# Altium schematic sheet d202.SchDoc
size C; SheetNumber: 1; SheetTotal: 5
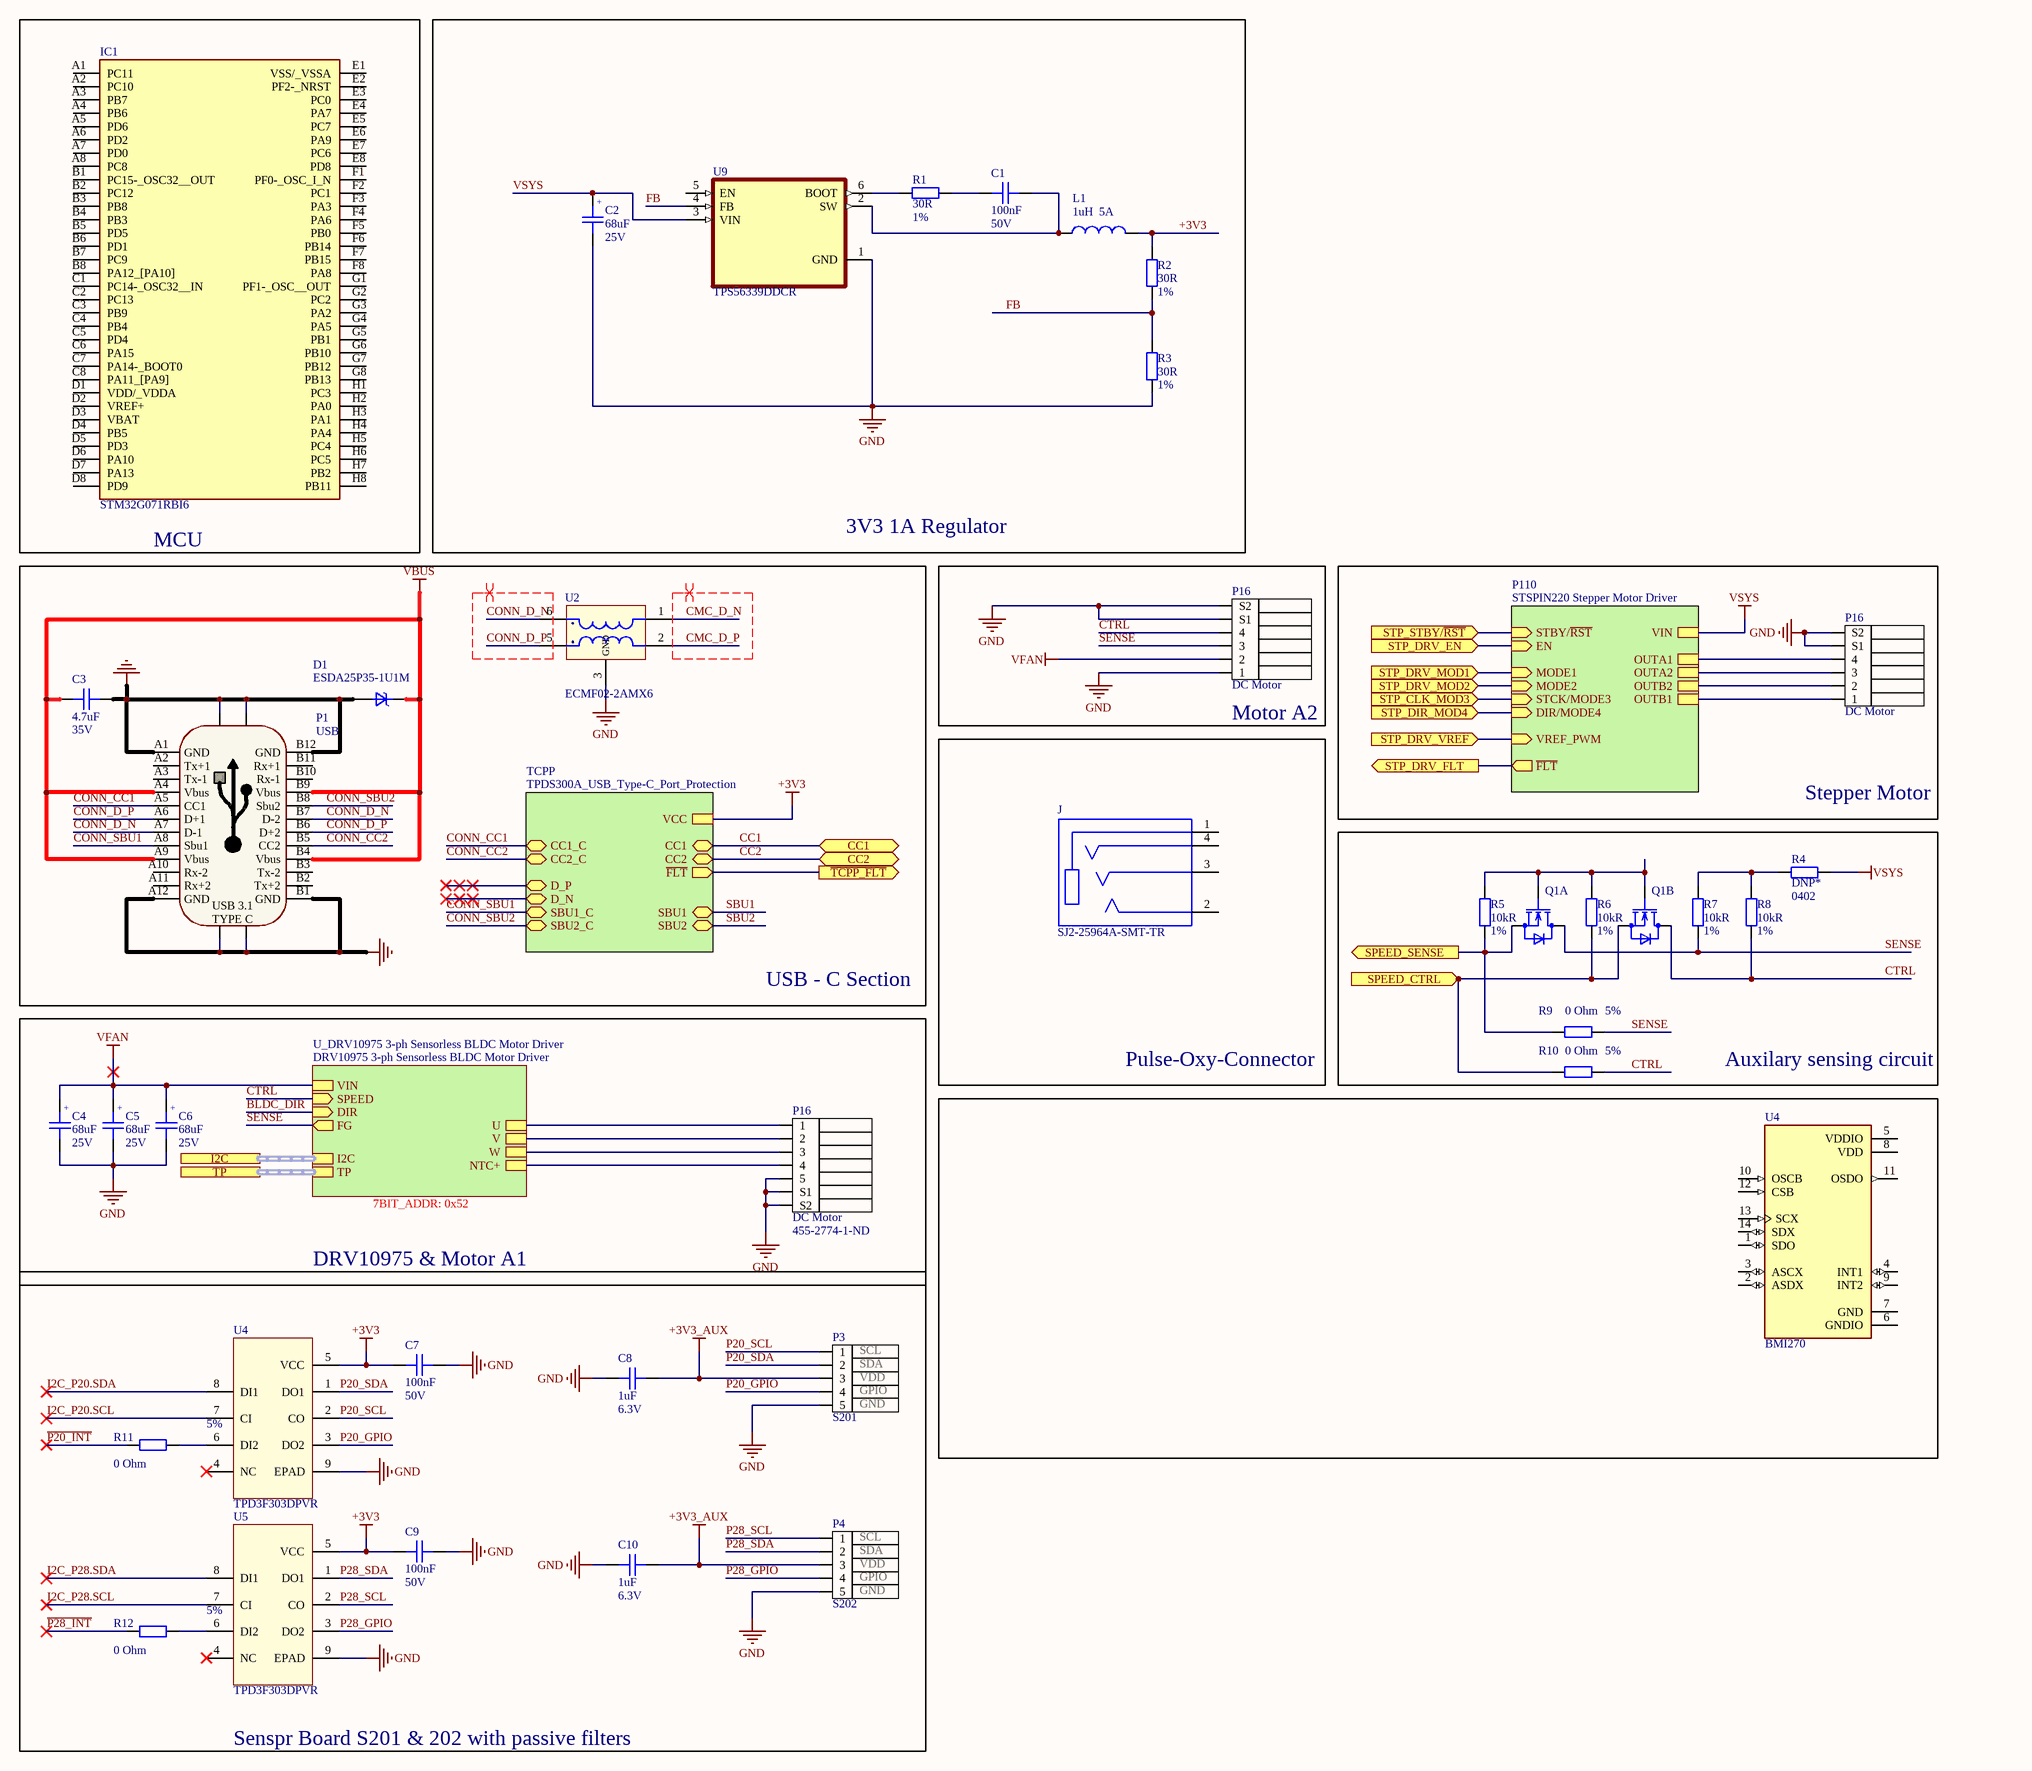
[diagram p0: d202.SchDoc]

## Parts
(Parts that share a designator on the sheet are numbered #1, #2 ... from top to bottom, then left to right.)
C1  Capacitance: 100nF  Voltage Rating: 50V  [C0402]  (hidden comment: CAP CER 1UF 6.3V X5R 0402)
C2  Capacitance: 68uF  Rated Voltage: 25V  [WCAP-ASLI_6.3x5.5]  (hidden comment: CAP ALUM 68 UF 20% 25 V SMD)
C3  Capacitance: 4.7uF  Voltage Rating: 35V  [C0805]  (hidden comment: CAP CER 4.7UF 35V X7R 0805)
C4  Capacitance: 68uF  Rated Voltage: 25V  [WCAP-ASLI_6.3x5.5]  (hidden comment: CAP ALUM 68 UF 20% 25 V SMD)
C5  Capacitance: 68uF  Rated Voltage: 25V  [WCAP-ASLI_6.3x5.5]  (hidden comment: CAP ALUM 68 UF 20% 25 V SMD)
C6  Capacitance: 68uF  Rated Voltage: 25V  [WCAP-ASLI_6.3x5.5]  (hidden comment: CAP ALUM 68 UF 20% 25 V SMD)
C7  Capacitance: 100nF  Voltage: 50V  [C0402]  (hidden comment: CAP CER 0.1UF 50V X7R 0402)
C8  Capacitance: 1uF  Voltage Rating: 6.3V  [C0402]  (hidden comment: CAP CER 1UF 6.3V X5R 0402)
C9  Capacitance: 100nF  Voltage: 50V  [C0402]  (hidden comment: CAP CER 0.1UF 50V X7R 0402)
C10  Capacitance: 1uF  Voltage Rating: 6.3V  [C0402]  (hidden comment: CAP CER 1UF 6.3V X5R 0402)
D1  ESDA25P35-1U1M  [ST_QFN_1610]
IC1  STM32G071RBI6  [BGA64C50P8X8_500X500X60]
J  SJ2-25964A-SMT-TR  [CUI_SJ2-25964A-SMT-TR]
L1  Inductance: 1uH  Current Rating: 5A  [IND_IHLP-1212B00]  (hidden comment: FIXED IND 1UH 5A 24 MOHM SMD)
P1  USB  [MOLEX_2012670005]
P3  S201  pin_1: SCL  pin_2: SDA  pin_3: VDD  pin_4: GPIO  pin_5: GND  [CONN_0545500571]
P4  S202  pin_1: SCL  pin_2: SDA  pin_3: VDD  pin_4: GPIO  pin_5: GND  [CONN_0545500571]
P16#1  DC Motor  [JST_S4B-ZR-SM4A-TF(LF)(SN)]
P16#2  DC Motor  [SM04B-NSHSS-TB (LF)(SN)]
P16#3  DC Motor  Supplier Part Number 1: 455-2774-1-ND  [JST_S5B-ZR-SM4A-TF(LF)(SN)]
Q1  DMN32D2LV-7  [SON_400UV-7_DIO]  (value not drawn)  (parts A,B of 2)
R1  Resistance: 30R  Tolerance: 1%  [R0402]  (hidden comment: RES SMD 10K OHM 1% 1/16W 0402)
R2  Resistance: 30R  Tolerance: 1%  [R0402]  (hidden comment: RES SMD 10K OHM 1% 1/16W 0402)
R3  Resistance: 30R  Tolerance: 1%  [R0402]  (hidden comment: RES SMD 10K OHM 1% 1/16W 0402)
R4  DNP*  Case/Package: 0402  [R0402]  (no BOM)
R5  Resistance: 10kR  Tolerance: 1%  [R0402]  (hidden comment: RES SMD 10K OHM 1% 1/16W 0402)
R6  Resistance: 10kR  Tolerance: 1%  [R0402]  (hidden comment: RES SMD 10K OHM 1% 1/16W 0402)
R7  Resistance: 10kR  Tolerance: 1%  [R0402]  (hidden comment: RES SMD 10K OHM 1% 1/16W 0402)
R8  Resistance: 10kR  Tolerance: 1%  [R0402]  (hidden comment: RES SMD 10K OHM 1% 1/16W 0402)
R9  Tolerance: 5%  Resistance: 0 Ohm  [R0402]  (hidden comment: RES SMD 0 OHM JUMPER 1/16W 0402)
R10  Tolerance: 5%  Resistance: 0 Ohm  [R0402]  (hidden comment: RES SMD 0 OHM JUMPER 1/16W 0402)
R11  Tolerance: 5%  Resistance: 0 Ohm  [R0402]  (hidden comment: RES SMD 0 OHM JUMPER 1/16W 0402)
R12  Tolerance: 5%  Resistance: 0 Ohm  [R0402]  (hidden comment: RES SMD 0 OHM JUMPER 1/16W 0402)
U2  ECMF02-2AMX6  [QFN-6L]
U4#1  BMI270  [XDCR_BMI270]
U4#2  TPD3F303DPVR  [DPV8_1P7X0P4]
U5  TPD3F303DPVR  [DPV8_1P7X0P4]
U9  TPS56339DDCR  [SOT95P280X110-6N]

## Blocks framed on the sheet
MCU: IC1
3V3 1A Regulator: C1 C2 L1 R1-R3 U9
USB - C Section: C3 D1 P1 U2
Motor A2: P16#1
Stepper Motor: P16#2
Pulse-Oxy-Connector: J
Auxilary sensing circuit: Q1 R4-R10
DRV10975 & Motor A1: C4-C6 P16#3
Senspr Board S201 & 202 with passive filters: C7-C10 P3 P4 R11 R12 U4#2 U5

## Sub-sheets
P110 = STSPIN220 Stepper Motor Driver: MODE1 (in), OUTB1, VREF_PWM (in), EN (in), MODE2 (in), OUTB2, OUTA2, DIR/MODE4 (in), STCK/MODE3 (in), ~{FLT} (out), STBY/~{RST} (in), OUTA1, VIN
TCPP = TPDS300A_USB_Type-C_Port_Protection: ~{FLT} (out), VCC, CC1 (bidir), CC2 (bidir), CC1_C (bidir), CC2_C (bidir), SBU1_C (bidir), SBU2_C (bidir), SBU1 (bidir), SBU2 (bidir), D_P (bidir), D_N (bidir)
U_DRV10975 3-ph Sensorless BLDC Motor Driver = DRV10975 3-ph Sensorless BLDC Motor Driver: U, V, W, VIN, SPEED (in), DIR (in), FG (out), I2C (harness I2C), TP (harness DRV10975_TP), NTC+  | 7BIT_ADDR: 0x52

## Ports
CC1 (bidir), CC2 (bidir), I2C (harness I2C), SPEED_CTRL (in), SPEED_SENSE (out), STP_CLK_MOD3 (in), STP_DIR_MOD4 (in), STP_DRV_EN (in), STP_DRV_FLT (out), STP_DRV_MOD1 (in), STP_DRV_MOD2 (in), STP_DRV_VREF (in), STP_STBY/~{RST} (in), TP, ~{TCPP_FLT} (out)

## Nets
+3V3: C7.1 C9.1 L1.2 R2.2 U4#2.5(VCC) U5.5(VCC) ; sheet TCPP/VCC
+3V3_AUX: C8.2 C10.2 P3.3 P4.3
GND: C2.2 C3.2 C4.2 C5.2 C6.2 C7.2 C8.1 C9.2 C10.1 D1.2(A) P1.A1(GND) P1.A12(GND) P1.B1(GND) P1.B12(GND) P1.S1 P1.S2 P1.S3 P1.S4 P3.0 P3.5 P4.0 P4.5 P16#1.1 P16#1.5(S1) P16#1.6(S2) P16#2.S1 P16#2.S2 P16#3.5 P16#3.S1 P16#3.S2 R3.1 U2.3(GND) U4#2.9(EPAD) U5.9(EPAD) U9.1(GND)
VBUS: C3.1 D1.1(K) P1.A4(Vbus) P1.A9(Vbus) P1.B4(Vbus) P1.B9(Vbus)
VFAN: C4.1 C5.1 C6.1 P16#1.2 ; sheet U_DRV10975 3-ph Sensorless BLDC Motor Driver/VIN
VSYS: C2.1 R4.1 U9.3(VIN) ; sheet P110/VIN
~{P20_INT}: R11.1
~{P28_INT}: R12.1
~{TCPP_FLT}: port ~{TCPP_FLT}, sheet TCPP/~{FLT}
BLDC_DIR: sheet U_DRV10975 3-ph Sensorless BLDC Motor Driver/DIR
CC1: port CC1, sheet TCPP/CC1
CC2: port CC2, sheet TCPP/CC2
CMC_D_N: U2.1(INP1)
CMC_D_P: U2.2(INP2)
CONN_CC1: P1.A5(CC1) ; sheet TCPP/CC1_C
CONN_CC2: P1.B5(CC2) ; sheet TCPP/CC2_C
CONN_D_N: P1.A7(D-1) P1.B7(D-2) U2.6(OUT1)
CONN_D_P: P1.A6(D+1) P1.B6(D+2) U2.5(OUT2)
CONN_SBU1: P1.A8(Sbu1) ; sheet TCPP/SBU1_C
CONN_SBU2: P1.B8(Sbu2) ; sheet TCPP/SBU2_C
CTRL: P16#1.4 Q1.3(D) R8.2 R10.2 ; sheet U_DRV10975 3-ph Sensorless BLDC Motor Driver/SPEED
FB: R2.1 R3.2 U9.4(FB)
I2C_P20.SCL: U4#2.7(CI)
I2C_P20.SDA: U4#2.8(DI1)
I2C_P28.SCL: U5.7(CI)
I2C_P28.SDA: U5.8(DI1)
P20_GPIO: P3.4 U4#2.3(DO2)
P20_SCL: P3.1 U4#2.2(CO)
P20_SDA: P3.2 U4#2.1(DO1)
P28_GPIO: P4.4 U5.3(DO2)
P28_SCL: P4.1 U5.2(CO)
P28_SDA: P4.2 U5.1(DO1)
SBU1: sheet TCPP/SBU1
SBU2: sheet TCPP/SBU2
SENSE: P16#1.3 Q1.6(D) R7.2 R9.2 ; sheet U_DRV10975 3-ph Sensorless BLDC Motor Driver/FG
SPEED_CTRL: Q1.4(S) R6.2 R10.1 ; port SPEED_CTRL
SPEED_SENSE: Q1.1(S) R5.2 R9.1 ; port SPEED_SENSE
STP_CLK_MOD3: port STP_CLK_MOD3, sheet P110/STCK/MODE3
STP_DIR_MOD4: port STP_DIR_MOD4, sheet P110/DIR/MODE4
STP_DRV_EN: port STP_DRV_EN, sheet P110/EN
STP_DRV_FLT: port STP_DRV_FLT, sheet P110/~{FLT}
STP_DRV_MOD1: port STP_DRV_MOD1, sheet P110/MODE1
STP_DRV_MOD2: port STP_DRV_MOD2, sheet P110/MODE2
STP_DRV_VREF: port STP_DRV_VREF, sheet P110/VREF_PWM
STP_STBY/~{RST}: port STP_STBY/~{RST}, sheet P110/STBY/~{RST}
NetC1_1: C1.1 R1.2
NetC1_2: C1.2 L1.1 U9.2(SW)
NetP16#2_1: P16#2.1 ; sheet P110/OUTB1
NetP16#2_2: P16#2.2 ; sheet P110/OUTB2
NetP16#2_3: P16#2.3 ; sheet P110/OUTA2
NetP16#2_4: P16#2.4 ; sheet P110/OUTA1
NetP16#3_1: P16#3.1 ; sheet U_DRV10975 3-ph Sensorless BLDC Motor Driver/U
NetP16#3_2: P16#3.2 ; sheet U_DRV10975 3-ph Sensorless BLDC Motor Driver/V
NetP16#3_3: P16#3.3 ; sheet U_DRV10975 3-ph Sensorless BLDC Motor Driver/W
NetP16#3_4: P16#3.4 ; sheet U_DRV10975 3-ph Sensorless BLDC Motor Driver/NTC+
NetQ1_2: Q1.2(G) Q1.5(G) R5.1 R6.1
NetR1_1: R1.1 U9.6(BOOT)
NetR4_2: R4.2 R7.1 R8.1
NetR11_2: R11.2 U4#2.6(DI2)
NetR12_2: R12.2 U5.6(DI2)

Not connected (* = marked no-connect by the designer): IC1 A1(PC11) A2(PC10) A3(PB7) A4(PB6) A5(PD6) A6(PD2) A7(PD0) A8(PC8) B1(PC15-_OSC32__OUT) B2(PC12) B3(PB8) B4(PB3) B5(PD5) B6(PD1) B7(PC9) B8(PA12_[PA10]) C1(PC14-_OSC32__IN) C2(PC13) C3(PB9) C4(PB4) C5(PD4) C6(PA15) C7(PA14-_BOOT0) C8(PA11_[PA9]) D1(VDD/_VDDA) D2(VREF+) D3(VBAT) D4(PB5) D5(PD3) D6(PA10) D7(PA13) D8(PD9) E1(VSS/_VSSA) E2(PF2-_NRST) E3(PC0) E4(PA7) E5(PC7) E6(PA9) E7(PC6) E8(PD8) F1(PF0-_OSC_I_N) F2(PC1) F3(PA3) F4(PA6) F5(PB0) F6(PB14) F7(PB15) F8(PA8) G1(PF1-_OSC__OUT) G2(PC2) G3(PA2) G4(PA5) G5(PB1) G6(PB10) G7(PB12) G8(PB13) H1(PC3) H2(PA0) H3(PA1) H4(PA4) H5(PC4) H6(PC5) H7(PB2) H8(PB11); J 1(SLEEVE) 2(TIP) 3(RING1) 4(RING2); P1 A2(Tx+1) A3(Tx-1) A10(Rx-2) A11(Rx+2) B2(Tx+2) B3(Tx-2) B10(Rx-1) B11(Rx+1); U2 4(NC); U4#1 1(SDO) 2(ASDX) 3(ASCX) 4(INT1) 5(VDDIO) 6(GNDIO) 7(GND) 8(VDD) 9(INT2) 10(OSCB) 11(OSDO) 12(CSB) 13(SCX) 14(SDX); U4#2 4(NC)*; U5 4(NC)*; U9 5(EN)

## Buses and harness runs
harness port I2C = sheet U_DRV10975 3-ph Sensorless BLDC Motor Driver/I2C
harness port TP = sheet U_DRV10975 3-ph Sensorless BLDC Motor Driver/TP

## Layout directives
differential pair: CMC_D_N, CMC_D_P, CONN_D_N, CONN_D_P

## Notes on the sheet
- (in symbol CAP ALUM 68 UF 20% 25 V SMD) +
- (in symbol CONN 2012670005 RCP USB3.1 TYPEC 24P SMD RA) USB 3.1; TYPE C

## Library data of the parts
C1 C8 C10 = CAP CER 1UF 6.3V X5R 0402: 1µF ±10% 6.3V Ceramic Capacitor X5R 0402 (1005 Metric); Manufacturer: Yageo; Manufacturer Part Number: CC0402KRX5R5BB105; Supplier 1: Digi-Key; Stock 1: 34926286; Pricing 1: 1=0.1, 10=0.05, 50=0.0272, 100=0.0222, 500=0.0158, 1000=0.0124, 2500=0.0113, 5000=0.0104 (USD); Mount: Surface Mount; Number of Pins: 2; Case Code (Imperial): 0402; Case Code (Metric): 1005; Min Operating Temperature: -55°C; Max Operating Temperature: 85°C; Tolerance: 10%; Packaging: Tape and Reel; Termination: SMD/SMT; Voltage Rating (DC): 6.3V; Composition: Ceramic; Length: 1mm; Height: 0.5mm; Width: 0.02inch; Thickness: 0.022inch; Depth: 0.5mm; Radiation Hardening: No; Lead Free: Lead Free; Halogen Free: Halogen Free; ComponentLink1URL: http://www.farnell.com/datasheets/70765.pdf?src-supplier=Farnell; ComponentLink1Description: http://www.farnell.com/datasheets/70765.pdf?src-supplier=Farnell; Supplier Part Number 1: 311-1438-1-ND; Dielectric: X5R; Case/Package: 0402; Dielectric Material: Ceramic; Package Quantity: 1; REACH SVHC: No SVHC; ComponentLink2URL: http://www.yageo.com/documents/recent/UPY-GPHC_X5R_4V-to-50V_25.pdf?src-supplier=Digi-Key; ComponentLink2Description: http://www.yageo.com/documents/recent/UPY-GPHC_X5R_4V-to-50V_25.pdf?src-supplier=Digi-Key; ComponentLink3URL: http://www.farnell.com/datasheets/2167237.pdf?src-supplier=Element14; ComponentLink3Description: http://www.farnell.com/datasheets/2167237.pdf?src-supplier=Element14; ComponentLink4URL: http://www.yageo.com/documents/recent/UPY-GPHC_X5R_4V-to-50V_12.pdf?src-supplier=Avnet+Europe; ComponentLink4Description: http://www.yageo.com/documents/recent/UPY-GPHC_X5R_4V-to-50V_12.pdf?src-supplier=Avnet+Europe; ComponentLink5URL: http://www.farnell.com/datasheets/1359354.pdf?src-supplier=Element14; ComponentLink5Description: http://www.farnell.com/datasheets/1359354.pdf?src-supplier=Element14; ComponentLink6URL: http://www.farnell.com/datasheets/70765.pdf?src-supplier=Element14; ComponentLink6Description: http://www.farnell.com/datasheets/70765.pdf?src-supplier=Element14; ComponentLink7URL: http://www.yageo.com/documents/recent/UPY-GPHC_X5R_4V-to-50V_12.pdf?src-supplier=Avnet; ComponentLink7Description: http://www.yageo.com/documents/recent/UPY-GPHC_X5R_4V-to-50V_12.pdf?src-supplier=Avnet
C2 C4-C6 = CAP ALUM 68 UF 20% 25 V SMD: 68µF 25V Aluminum Electrolytic Capacitors Radial, Can - SMD  2000 Hrs @ 105°C; Manufacturer: Wurth Elektronik; Manufacturer Part Number: 865080443009; Dissipation Factor: 14%; Endurance: 2000h; Leakage Current: 17uA; Ripple Current: 240mA; Capacitance Tolerance: +/-20%; Technical Reference: ASED055680M025DVCTBB000; Supplier 1: Digi-Key; Packaging: Tape and Reel; ComponentLink1URL: http://www.we-online.de; ComponentLink1Description: Manufacturer; Supplier Part Number 1: 732-8437-1-ND; Diameter: 6.3mm; Height: 5.5mm; ComponentLink2URL: https://www.we-online.com/catalog/datasheet/865080443009.pdf; ComponentLink2Description: Datasheet; Mounting Technology: SMT; Operating Temperature: -55 to +105degC; Published Date: May 2020; Mount: Surface Mount
C3 = CAP CER 4.7UF 35V X7R 0805: Manufacturer: TDK; Manufacturer Part Number: C2012X7R1V475K125AC; Dielectric Material: Ceramic; Tolerance: 10%; Supplier 1: Digi-Key; Stock 1: 109602; Pricing 1: 1=0.73, 10=0.519, 50=0.3752, 100=0.3416, 500=0.253, 1000=0.2151 (USD); Mount: Surface Mount; Case/Package: 0805; Weight: 0.000194oz; Case Code (Metric): 2012; Case Code (Imperial): 0805; Min Operating Temperature: -55°C; Max Operating Temperature: 125°C; Packaging: Tape and Reel; Package Quantity: 2000; Dielectric: X7R; Termination: SMD/SMT; Voltage Rating (DC): 35V; Length: 2mm; Height: 1.25mm; Width: 0.049inch; Thickness: 0.057inch; Depth: 1.25mm; Radiation Hardening: No; REACH SVHC: No SVHC; Lead Free: Lead Free; ComponentLink1URL: http://www.farnell.com/datasheets/2792994.pdf?src-supplier=Element14; ComponentLink1Description: http://www.farnell.com/datasheets/2792994.pdf?src-supplier=Element14; ComponentLink2URL: https://product.tdk.com/info/en/catalog/datasheets/mlcc_commercial_general_en.pdf?src-supplier=Digi-Key; ComponentLink2Description: https://product.tdk.com/info/en/catalog/datasheets/mlcc_commercial_general_en.pdf?src-supplier=Digi-Key; ComponentLink3URL: https://product.tdk.com/info/en/catalog/spec/mlccspec_commercial_general_midvoltage_en.pdf?src-supplier=Digi-Key; ComponentLink3Description: https://product.tdk.com/info/en/catalog/spec/mlccspec_commercial_general_midvoltage_en.pdf?src-supplier=Digi-Key; Supplier Part Number 1: 445-7555-1-ND
C7 C9 = CAP CER 0.1UF 50V X7R 0402: 0.1µF ±10% 50V Ceramic Capacitor X7R 0402 (1005 Metric); Manufacturer: TDK; Manufacturer Part Number: CGA2B3X7R1H104K050BB; Supplier 1: Digi-Key; Stock 1: 2925303; Pricing 1: 1=0.17, 10=0.118, 50=0.0668, 100=0.0553, 500=0.0388, 1000=0.0321, 2500=0.0299, 5000=0.0273 (USD); Mount: Surface Mount; Case/Package: 0402; Weight: 2.3E-05oz; Case Code (Metric): 1005; Case Code (Imperial): 0402; Min Operating Temperature: -55°C; Max Operating Temperature: 125°C; Voltage Rating: 50V; Tolerance: 10%; Packaging: Tape and Reel; Package Quantity: 1; Voltage Rating (DC): 50V; Dielectric: X7R; Termination: SMD/SMT; Composition: Ceramic; Length: 1mm; Height: 0.5mm; Width: 0.02inch; Thickness: 0.022inch; Depth: 0.5mm; Ratings: AEC-Q200; REACH SVHC: No SVHC; Lead Free: Lead Free; ComponentLink1URL: http://product.tdk.com/capacitor/mlcc/en/documents/mlccspec_automotive_general_midvoltage_en.pdf?src-supplier=Future+Electronics; ComponentLink1Description: http://product.tdk.com/capacitor/mlcc/en/documents/mlccspec_automotive_general_midvoltage_en.pdf?src-supplier=Future+Electronics; ComponentLink2URL: http://www.farnell.com/datasheets/1807242.pdf?src-supplier=Element14; ComponentLink2Description: http://www.farnell.com/datasheets/1807242.pdf?src-supplier=Element14; ComponentLink3URL: http://www.mouser.com/ds/2/400/lcc_automotive_general_en-843974.pdf?src-supplier=Mouser; ComponentLink3Description: http://www.mouser.com/ds/2/400/lcc_automotive_general_en-843974.pdf?src-supplier=Mouser; ComponentLink4URL: http://www.farnell.com/datasheets/1936565.pdf?src-supplier=Element14; ComponentLink4Description: http://www.farnell.com/datasheets/1936565.pdf?src-supplier=Element14; ComponentLink5URL: http://www.farnell.com/datasheets/1735392.pdf?src-supplier=Element14; ComponentLink5Description: http://www.farnell.com/datasheets/1735392.pdf?src-supplier=Element14; Supplier Part Number 1: 445-6899-1-ND
D1 = TVS DIODE ESDA25P35-1U1M 22V 41V 1610: 41V Clamp 35A (8/20µs) Ipp Tvs Diode Surface Mount 1610; Manufacturer: STMicroelectronics; Number of Unidirectional Channels: 1; Reverse Standoff Voltage: 22V; Min Breakdown Voltage: 23.3V; Peak Pulse Power: 1.4kW; Power Line Protection: No; Supplier 1: Digi-Key; Manufacturer Part Number: ESDA25P35-1U1M; Stock 1: 12413; Pricing 1: 1=0.45, 10=0.362, 25=0.3312, 100=0.2079, 250=0.2056, 500=0.1925, 1000=0.1309, 2500=0.1255 (USD); Mount: Surface Mount; Case/Package: 1610; Number of Pins: 2; Min Operating Temperature: -55°C; Max Operating Temperature: 150°C; Composition: Zener; Packaging: Tape and Reel; Clamping Voltage: 41V; Peak Pulse Current: 35A; ComponentLink1URL: http://www.st.com/content/ccc/resource/technical/document/datasheet/group3/e4/43/53/b9/4e/8a/40/bb/DM00312034/files/DM00312034.pdf/jcr:content/translations/en.DM00312034.pdf?src-supplier=Digi-Key; ComponentLink1Description: http://www.st.com/content/ccc/resource/technical/document/datasheet/group3/e4/43/53/b9/4e/8a/40/bb/DM00312034/files/DM00312034.pdf/jcr:content/translations/en.DM00312034.pdf?src-supplier=Digi-Key; ComponentLink2URL: http://www.farnell.com/datasheets/2236209.pdf?src-supplier=Farnell; ComponentLink2Description: http://www.farnell.com/datasheets/2236209.pdf?src-supplier=Farnell; ComponentLink3URL: http://www.farnell.com/datasheets/2236209.pdf?src-supplier=Element14; ComponentLink3Description: http://www.farnell.com/datasheets/2236209.pdf?src-supplier=Element14; ComponentLink4URL: http://www.farnell.com/datasheets/2236209.pdf?src-supplier=Newark; ComponentLink4Description: http://www.farnell.com/datasheets/2236209.pdf?src-supplier=Newark; Supplier Part Number 1: 497-16913-1-ND
IC1 = STM32G071RBI6: Integrated Circuit; Manufacturer_Name: STMicroelectronics; Datasheet Link: https://media.digikey.com/pdf/Data%20Sheets/ST%20Microelectronics%20PDFS/STM32G071_Rev1_DS.pdf; Height: 0.6mm; Manufacturer_Part_Number: STM32G071RBI6
J = SJ2-25964A-SMT-TR: 2.5 mm, Stereo, Right Angle, Surface Mount (SMT), Audio Jack Connector; MF: CUI Devices; Package: None; Availability: Unavailable; Value: *; MP: SJ2-25964A-SMT-TR; SnapEDA_Link: https://www.snapeda.com/parts/SJ2-25964A-SMT-TR/CUI%20Devices/view-part/1316417/?ref=snap; Price: None
L1 = FIXED IND 1UH 5A 24 MOHM SMD: 1µH Shielded Molded Inductor 5A 24mOhm Max Nonstandard; Manufacturer: Vishay Dale; Manufacturer Part Number: IHLP1212BZER1R0M11; Core Material: Metal,Composite; Tolerance: 20%; DC Resistance (DCR): 24mR; Self Resonant Frequency: 75MHz; Saturation Current: 4.5A; Test Frequency: 100kHz; Supplier 1: Digi-Key; Stock 1: 70286; Pricing 1: 1=1.39, 10=1.287, 25=1.188, 50=0.99, 100=0.9306, 250=0.8316, 500=0.7128, 1000=0.6336 (USD); Mount: Surface Mount; Case/Package: 1212; Number of Pins: 2; Case Code (Metric): 3630; Case Code (Imperial): 1212; Contact Plating: Tin; Min Operating Temperature: -55°C; Max Operating Temperature: 125°C; Shielding: Shielded; Packaging: Tape and Reel; Package Quantity: 3000; Inductance Tolerance: 20%; Max DC Current: 5A; Termination: SMD/SMT; RMS Current (Irms): 5A; Military Standard: Not; Length: 3.6mm; Height: 2mm; Depth: 3.2mm; Width: 0.118inch; Height - Seated (Max): 0.079inch; Radiation Hardening: No; REACH SVHC: Unknown; Lead Free: Lead Free; ComponentLink1URL: http://www.mouser.com/ds/2/427/lp12bz11-244380.pdf?src-supplier=Mouser; ComponentLink1Description: http://www.mouser.com/ds/2/427/lp12bz11-244380.pdf?src-supplier=Mouser; ComponentLink2URL: http://www.vishay.com/docs/34289/lp12bz11.pdf?src-supplier=Digi-Key; ComponentLink2Description: http://www.vishay.com/docs/34289/lp12bz11.pdf?src-supplier=Digi-Key; ComponentLink3URL: http://www.vishay.com/docs/34289/lp12bz11.pdf?src-supplier=Avnet; ComponentLink3Description: http://www.vishay.com/docs/34289/lp12bz11.pdf?src-supplier=Avnet; ComponentLink4URL: http://www.farnell.com/datasheets/652599.pdf?src-supplier=Element14; ComponentLink4Description: http://www.farnell.com/datasheets/652599.pdf?src-supplier=Element14; ComponentLink5URL: http://www.vishay.com/docs/34289/lp12bz11.pdf?src-supplier=Avnet+Europe; ComponentLink5Description: http://www.vishay.com/docs/34289/lp12bz11.pdf?src-supplier=Avnet+Europe; ComponentLink6URL: https://www.verical.com/server-webapp/html/getDatasheet?partID=180380&src-supplier=Verical; ComponentLink6Description: https://www.verical.com/server-webapp/html/getDatasheet?partID=180380&src-supplier=Verical; Supplier Part Number 1: 541-1319-1-ND
P1 = CONN 2012670005 RCP USB3.1 TYPEC 24P SMD RA: USB-C (USB TYPE-C) USB 3.2 Gen 2 (USB 3.1 Gen 2, Superspeed + (USB 3.1)) Receptacle Connector 24 Position Surface Mount, Right Angle; Through Hole; Manufacturer: Molex; Manufacturer Part Number: 201267-0005; Number of Contacts: 24; Number of Ports: 1; Current Rating: 5A; Voltage Rating: 30V; Mating Cycles: 20000; Shielding: Shielded; Supplier 1: Digi-Key; Stock 1: 2580; Pricing 1: 1=2.34, 10=1.997, 100=1.6496 (USD); Mount: Surface Mount,Through Hole; Packaging: Tape and Reel; Connector Type: USB; Gender: Receptacle; ComponentLink1URL: https://www.molex.com/pdm_docs/sd/2012670005_sd.pdf?src-supplier=Digi-Key; ComponentLink1Description: https://www.molex.com/pdm_docs/sd/2012670005_sd.pdf?src-supplier=Digi-Key; ComponentLink2URL: http://www.farnell.com/datasheets/2722545.pdf?src-supplier=Element14; ComponentLink2Description: http://www.farnell.com/datasheets/2722545.pdf?src-supplier=Element14; Supplier Part Number 1: WM17992CT-ND; Contact Plating: Gold; Insulation Color: Black; Min Operating Temperature: -40°C; Max Operating Temperature: 105°C; Termination: Solder; Flammability Rating: UL94 V-0; ComponentLink3URL: http://www.farnell.com/datasheets/2722545.pdf?src-supplier=Newark; ComponentLink3Description: http://www.farnell.com/datasheets/2722545.pdf?src-supplier=Newark; ComponentLink4URL: https://www.molex.com/pdm_docs/pk/2012670005-PK1.pdf?src-supplier=Digi-Key; ComponentLink4Description: https://www.molex.com/pdm_docs/pk/2012670005-PK1.pdf?src-supplier=Digi-Key; ComponentLink5URL: http://www.farnell.com/datasheets/2722545.pdf?src-supplier=Farnell; ComponentLink5Description: http://www.farnell.com/datasheets/2722545.pdf?src-supplier=Farnell
P3 P4 = CONN FFC FPC TOP 5POS 0.50MM R/A: 5 Position FFC, FPC Connector Contacts, Top 0.020" (0.50mm) Surface Mount, Right Angle; Manufacturer: Molex; Manufacturer Part Number: 0545500571; Number of Positions: 5; Pitch: 0.02inch; Current Rating: 500mA; Voltage Rating: 50V; Contact Resistance: 40mR; Actuator Material: Polyphenylene; Wire/Cable Type: Straight; Supplier 1: Digi-Key; Stock 1: 20865; Pricing 1: 1=0.98, 10=0.808, 100=0.673, 1000=0.5384 (USD); Mount: Surface Mount; Housing Material: Polymer; Contact Plating: Gold; Min Operating Temperature: -20°C; Max Operating Temperature: 85°C; Number of Rows: 1; Packaging: Tape and Reel; Termination: Solder; Orientation: Right Angle; ComponentLink1URL: http://www.molex.com/webdocs/datasheets/pdf/en-us/0545500571_FFC_FPC_CONNECTORS.pdf?src-supplier=Avnet; ComponentLink1Description: http://www.molex.com/webdocs/datasheets/pdf/en-us/0545500571_FFC_FPC_CONNECTORS.pdf?src-supplier=Avnet; Supplier Part Number 1: WM8824CT-ND; Length: 7.7mm; Depth: 5mm; Contact Material: Bronze; Package Quantity: 1; Radiation Hardening: No; Flammability Rating: UL94 V-0
P16#1 = JST_S4B-ZR-SM4A-TF(LF)(SN): Connector Header Through Hole, Right Angle 4 position 0.059" (1.50mm); pin to pad: 5>S1 6>S2; Manufacturer: JST; Manufacturer Part Number: S4B-ZR(LF)(SN); Body Plating: Tin; Number of Positions: 4; Connector Type: Header,Male Pin; Voltage Rating: 50V; Contact Resistance: 30mR; Max Current Rating: 1A; Insulation Resistance: 500MR; Gender: Male; Pitch: 1.5mm; Panel Thickness: 3.5mm; Supplier 1: Arrow; Stock 1: 0; Mount: Through Hole; Number of Pins: 4; Color: White; Contact Plating: Tin,Copper; Contact Material: Brass,Tin,Copper; Material: Nylon; Housing Color: Beige; Housing Material: Polyamide; Contact Shape: Circular; Insulation Material: Nylon; Insulation Color: Natural; Min Operating Temperature: -25°C; Max Operating Temperature: 85°C; Packaging: Bulk; Number of Rows: 1; Termination: Solder; Voltage Rating (DC): 50V; Current Rating: 1A; Voltage Rating (AC): 50V; Fastening Type: Detent; Max Voltage Rating (AC): 50V; Max Voltage Rating (DC): 50V; Number of Contacts: 4; Orientation: Right Angle; Length: 7.5mm; Height: 7.2mm; Width: 3.5mm; Depth: 6mm; Lead Pitch: 1.5mm; Contact Mating Length: 0.094inch; REACH SVHC: No SVHC; Lead Free: Lead Free; Flammability Rating: UL94 V-0; ComponentLink1URL: https://www.verical.com/server-webapp/html/getDatasheet?partID=763273&src-supplier=Verical; ComponentLink1Description: https://www.verical.com/server-webapp/html/getDatasheet?partID=763273&src-supplier=Verical; ComponentLink2URL: https://www.verical.com/server-webapp/html/getDatasheet?partID=640380&src-supplier=Verical; ComponentLink2Description: https://www.verical.com/server-webapp/html/getDatasheet?partID=640380&src-supplier=Verical; ComponentLink3URL: http://www1.futureelectronics.com/doc/JST/S4B-ZR(LF)(SN).pdf?src-supplier=Future+Electronics; ComponentLink3Description: http://www1.futureelectronics.com/doc/JST/S4B-ZR(LF)(SN).pdf?src-supplier=Future+Electronics; ComponentLink4URL: http://www.jst-mfg.com/product/pdf/eng/eZH.pdf?src-supplier=Digi-Key; ComponentLink4Description: http://www.jst-mfg.com/product/pdf/eng/eZH.pdf?src-supplier=Digi-Key; ComponentLink5URL: http://www.farnell.com/datasheets/80556.pdf?src-supplier=Element14; ComponentLink5Description: http://www.farnell.com/datasheets/80556.pdf?src-supplier=Element14; ComponentLink6URL: https://www.verical.com/server-webapp/html/getDatasheet?partID=703398&src-supplier=Verical; ComponentLink6Description: https://www.verical.com/server-webapp/html/getDatasheet?partID=703398&src-supplier=Verical; Supplier Part Number 1: S4B-ZR(LF)(SN)
P16#2 = SM04B-NSHSS-TB (LF)(SN): Connector Header SMD, Right Angle 4 position 0.039" (1.0mm); Manufacturer: JST; Manufacturer Part Number: S4B-ZR(LF)(SN); Body Plating: Tin; Number of Positions: 4; Connector Type: Header,Male Pin; Voltage Rating: 50V; Contact Resistance: 30mR; Max Current Rating: 1A; Insulation Resistance: 500MR; Gender: Male; Pitch: 1.5mm; Panel Thickness: 3.5mm; Supplier 1: Arrow; Stock 1: 0; Mount: Through Hole; Number of Pins: 4; Color: White; Contact Plating: Tin,Copper; Contact Material: Brass,Tin,Copper; Material: Nylon; Housing Color: Beige; Housing Material: Polyamide; Contact Shape: Circular; Insulation Material: Nylon; Insulation Color: Natural; Min Operating Temperature: -25°C; Max Operating Temperature: 85°C; Packaging: Bulk; Number of Rows: 1; Termination: Solder; Voltage Rating (DC): 50V; Current Rating: 1A; Voltage Rating (AC): 50V; Fastening Type: Detent; Max Voltage Rating (AC): 50V; Max Voltage Rating (DC): 50V; Number of Contacts: 4; Orientation: Right Angle; Length: 7.5mm; Height: 7.2mm; Width: 3.5mm; Depth: 6mm; Lead Pitch: 1.5mm; Contact Mating Length: 0.094inch; REACH SVHC: No SVHC; Lead Free: Lead Free; Flammability Rating: UL94 V-0; ComponentLink1URL: https://www.verical.com/server-webapp/html/getDatasheet?partID=763273&src-supplier=Verical; ComponentLink1Description: https://www.verical.com/server-webapp/html/getDatasheet?partID=763273&src-supplier=Verical; ComponentLink2URL: https://www.verical.com/server-webapp/html/getDatasheet?partID=640380&src-supplier=Verical; ComponentLink2Description: https://www.verical.com/server-webapp/html/getDatasheet?partID=640380&src-supplier=Verical; ComponentLink3URL: http://www1.futureelectronics.com/doc/JST/S4B-ZR(LF)(SN).pdf?src-supplier=Future+Electronics; ComponentLink3Description: http://www1.futureelectronics.com/doc/JST/S4B-ZR(LF)(SN).pdf?src-supplier=Future+Electronics; ComponentLink4URL: http://www.jst-mfg.com/product/pdf/eng/eZH.pdf?src-supplier=Digi-Key; ComponentLink4Description: http://www.jst-mfg.com/product/pdf/eng/eZH.pdf?src-supplier=Digi-Key; ComponentLink5URL: http://www.farnell.com/datasheets/80556.pdf?src-supplier=Element14; ComponentLink5Description: http://www.farnell.com/datasheets/80556.pdf?src-supplier=Element14; ComponentLink6URL: https://www.verical.com/server-webapp/html/getDatasheet?partID=703398&src-supplier=Verical; ComponentLink6Description: https://www.verical.com/server-webapp/html/getDatasheet?partID=703398&src-supplier=Verical; Supplier Part Number 1: S4B-ZR(LF)(SN)
P16#3 = JST_S5B-ZR-SM4A-TF(LF)(SN): Connector Header SMD, Right Angle 4 position 0.059" (1.50mm); Manufacturer: JST; Manufacturer Part Number: S4B-ZR(LF)(SN); Body Plating: Tin; Number of Positions: 4; Connector Type: Header,Male Pin; Voltage Rating: 50V; Contact Resistance: 30mR; Max Current Rating: 1A; Insulation Resistance: 500MR; Gender: Male; Pitch: 1.5mm; Panel Thickness: 3.5mm; Stock 1: 0; Mount: Through Hole; Number of Pins: 4; Color: White; Contact Plating: Tin,Copper; Contact Material: Brass,Tin,Copper; Material: Nylon; Housing Color: Beige; Housing Material: Polyamide; Contact Shape: Circular; Insulation Material: Nylon; Insulation Color: Natural; Min Operating Temperature: -25°C; Max Operating Temperature: 85°C; Packaging: Bulk; Number of Rows: 1; Termination: Solder; Voltage Rating (DC): 50V; Current Rating: 1A; Voltage Rating (AC): 50V; Fastening Type: Detent; Max Voltage Rating (AC): 50V; Max Voltage Rating (DC): 50V; Number of Contacts: 4; Orientation: Right Angle; Length: 7.5mm; Height: 7.2mm; Width: 3.5mm; Depth: 6mm; Lead Pitch: 1.5mm; Contact Mating Length: 0.094inch; REACH SVHC: No SVHC; Lead Free: Lead Free; Flammability Rating: UL94 V-0; ComponentLink1URL: https://www.verical.com/server-webapp/html/getDatasheet?partID=763273&src-supplier=Verical; ComponentLink1Description: https://www.verical.com/server-webapp/html/getDatasheet?partID=763273&src-supplier=Verical; ComponentLink2URL: https://www.verical.com/server-webapp/html/getDatasheet?partID=640380&src-supplier=Verical; ComponentLink2Description: https://www.verical.com/server-webapp/html/getDatasheet?partID=640380&src-supplier=Verical; ComponentLink3URL: http://www1.futureelectronics.com/doc/JST/S4B-ZR(LF)(SN).pdf?src-supplier=Future+Electronics; ComponentLink3Description: http://www1.futureelectronics.com/doc/JST/S4B-ZR(LF)(SN).pdf?src-supplier=Future+Electronics; ComponentLink4URL: http://www.jst-mfg.com/product/pdf/eng/eZH.pdf?src-supplier=Digi-Key; ComponentLink4Description: http://www.jst-mfg.com/product/pdf/eng/eZH.pdf?src-supplier=Digi-Key; ComponentLink5URL: http://www.farnell.com/datasheets/80556.pdf?src-supplier=Element14; ComponentLink5Description: http://www.farnell.com/datasheets/80556.pdf?src-supplier=Element14; ComponentLink6URL: https://www.verical.com/server-webapp/html/getDatasheet?partID=703398&src-supplier=Verical; ComponentLink6Description: https://www.verical.com/server-webapp/html/getDatasheet?partID=703398&src-supplier=Verical; Supplier 1: Digi-Key
Q1 = ARRAY MOSFET 2N-CH 30V 0.4A SOT-563: Mosfet Array 2 N-Channel (Dual) 30V 400mA 400mW Surface Mount SOT-563; Manufacturer: Diodes; Gate to Source Voltage (Vgs): 10V; Rds On Max: 1.2R; Input Capacitance: 39pF; Number of Channels: 2; Supplier 1: Digi-Key; Manufacturer Part Number: DMN32D2LV-7; Stock 1: 141366; Pricing 1: 1=0.39, 10=0.338, 25=0.3152, 100=0.234, 500=0.1827, 1000=0.1485 (USD); Mount: Surface Mount; Min Operating Temperature: -55°C; Max Operating Temperature: 150°C; Continuous Drain Current (ID): 400mA; Package Quantity: 3000; Packaging: Tape and Reel; Drain to Source Voltage (Vdss): 30V; Max Power Dissipation: 400mW; Drain to Source Breakdown Voltage: 30V; Drain to Source Resistance: 1.2R; Element Configuration: Dual; FET Type: 2 N-Channel; Length: 1.6mm; Height: 0.6mm; Width: 1.2mm; Radiation Hardening: No; REACH SVHC: No SVHC; ComponentLink1URL: https://www.diodes.com/assets/Datasheets/ds31121.pdf?src-supplier=Digi-Key; ComponentLink1Description: https://www.diodes.com/assets/Datasheets/ds31121.pdf?src-supplier=Digi-Key; ComponentLink2URL: http://www.mouser.com/ds/2/115/ds31121-89496.pdf?src-supplier=Mouser; ComponentLink2Description: http://www.mouser.com/ds/2/115/ds31121-89496.pdf?src-supplier=Mouser; ComponentLink3URL: http://www.diodes.com///datasheets/ds31121.pdf?src-supplier=Avnet; ComponentLink3Description: http://www.diodes.com///datasheets/ds31121.pdf?src-supplier=Avnet; Supplier Part Number 1: DMN32D2LV-7DICT-ND; Case/Package: SOT-563; Weight: 0.000106oz; Polarity: N-CHANNEL; Series: -
R1-R3 R5-R8 = RES SMD 10K OHM 1% 1/16W 0402: 10 kOhms ±1% 0.063W, 1/16W Chip Resistor 0402 (1005 Metric) Moisture Resistant Thick Film; Manufacturer Part Number: RC0402FR-0710KP; Manufacturer: Yageo; Temperature Coefficient: 150ppm/°C; Max Power Dissipation: 63mW; Supplier 1: Digi-Key; Stock 1: 839368; Pricing 1: 1=0.1, 10=0.035, 100=0.014, 1000=0.0063, 2500=0.0055, 5000=0.0045 (USD); Case Code (Imperial): 0402; Case Code (Metric): 1005; Min Operating Temperature: -55°C; Max Operating Temperature: 155°C; Composition: Thick Film; Packaging: Tape and Reel; Number of Terminations: 2; Length: 0.039inch; Height: 0.016inch; Width: 0.02inch; ComponentLink1URL: http://www.yageo.com/NewPortal/yageodocoutput?fileName=/pdf/R-Chip/PYu-RC_51_RoHS_P_0.pdf&src-supplier=Digi-Key; ComponentLink1Description: http://www.yageo.com/NewPortal/yageodocoutput?fileName=/pdf/R-Chip/PYu-RC_51_RoHS_P_0.pdf&src-supplier=Digi-Key; Supplier Part Number 1: YAG1249CT-ND; Case/Package: 0402; Features: Moisture Resistant; Mount: Surface Mount
R4 = RES SMD NO BOM 0402: Placeholder for a 0402 resistor
R9-R12 = RES SMD 0 OHM JUMPER 1/16W 0402: 0 Ohms Jumper 0.063W, 1/16W Chip Resistor 0402 (1005 Metric) Moisture Resistant Thick Film; Manufacturer: Yageo; Manufacturer Part Number: RC0402JR-070RL; Power Rating: 62.5mW; Voltage Rating: 50V; Max Power Dissipation: 63mW; Temperature Coefficient: 200ppm/°C; Supplier 1: Digi-Key; Stock 1: 46057148; Pricing 1: 1=0.1, 10=0.013, 25=0.0092, 50=0.0072, 100=0.0053, 250=0.004, 500=0.0032, 1000=0.0024, 5000=0.0017 (USD); Contact Plating: Tin,Matte; Case Code (Metric): 1005; Case Code (Imperial): 0402; Min Operating Temperature: -55°C; Max Operating Temperature: 155°C; Packaging: Tape and Reel; Composition: Thick Film; Package Quantity: 1; Number of Terminations: 2; Termination: SMD/SMT; Military Standard: Not; Features: Moisture Resistant; Length: 1mm; Height: 0.016inch; Width: 0.02inch; Depth: 0.5mm; Radiation Hardening: No; REACH SVHC: Unknown; Lead Free: Lead Free; ComponentLink1URL: http://www.yageo.com/documents/recent/PYu-RC_Group_51_RoHS_L_10.pdf?src-supplier=Digi-Key; ComponentLink1Description: http://www.yageo.com/documents/recent/PYu-RC_Group_51_RoHS_L_10.pdf?src-supplier=Digi-Key; ComponentLink2URL: http://www.yageo.com/documents/recent/PYu-RC0402_51_RoHS_L_6.pdf?src-supplier=Avnet+Europe; ComponentLink2Description: http://www.yageo.com/documents/recent/PYu-RC0402_51_RoHS_L_6.pdf?src-supplier=Avnet+Europe; ComponentLink3URL: http://www.farnell.com/datasheets/1018594.pdf?src-supplier=Element14; ComponentLink3Description: http://www.farnell.com/datasheets/1018594.pdf?src-supplier=Element14; ComponentLink4URL: https://www.verical.com/server-webapp/html/getDatasheet?partID=326379&src-supplier=Verical; ComponentLink4Description: https://www.verical.com/server-webapp/html/getDatasheet?partID=326379&src-supplier=Verical; ComponentLink5URL: http://www.farnell.com/datasheets/2167052.pdf?src-supplier=Element14; ComponentLink5Description: http://www.farnell.com/datasheets/2167052.pdf?src-supplier=Element14; Supplier Part Number 1: 311-0.0JRCT-ND; Case/Package: 0402; Mount: Surface Mount
U2 = CMC 200MA 2LN SMD ESD: 2 Line Common Mode Choke Surface Mount  200mA DCR 2.5Ohm; Manufacturer: STMicroelectronics; Number of Lines: 2; DC Resistance (DCR): 2.5R; Supplier 1: Digi-Key; Manufacturer Part Number: ECMF02-2AMX6; Stock 1: 23653; Pricing 1: 1=0.48, 10=0.418, 25=0.3888, 50=0.3288, 100=0.2989, 250=0.281, 500=0.2511, 1000=0.2033 (USD); Mount: Surface Mount; Case/Package: QFN; Number of Pins: 6; Min Operating Temperature: -40°C; Max Operating Temperature: 85°C; Packaging: Tape and Reel; Package Quantity: 1; Current: 200mA; Termination: Flat; Max Current Rating: 200mA; Current Rating: 200mA; Length: 1.75mm; Height: 0.022inch; Width: 0.059inch; Depth: 1.55mm; Radiation Hardening: No; Lead Free: Lead Free; REACH SVHC: No SVHC; ComponentLink1URL: http://www.st.com/web/en/resource/technical/document/datasheet/CD00282307.pdf?src-supplier=Future+Electronics; ComponentLink1Description: http://www.st.com/web/en/resource/technical/document/datasheet/CD00282307.pdf?src-supplier=Future+Electronics; ComponentLink2URL: http://www.st.com/content/ccc/resource/technical/document/datasheet/3a/28/cf/d0/31/63/48/8c/CD00282307.pdf/files/CD00282307.pdf/jcr:content/translations/en.CD00282307.pdf?src-supplier=Digi-Key; ComponentLink2Description: http://www.st.com/content/ccc/resource/technical/document/datasheet/3a/28/cf/d0/31/63/48/8c/CD00282307.pdf/files/CD00282307.pdf/jcr:content/translations/en.CD00282307.pdf?src-supplier=Digi-Key; ComponentLink3URL: http://www.mouser.com/ds/2/389/ecmf02-2amx6-954491.pdf?src-supplier=Mouser; ComponentLink3Description: http://www.mouser.com/ds/2/389/ecmf02-2amx6-954491.pdf?src-supplier=Mouser; ComponentLink4URL: https://www.verical.com/server-webapp/html/getDatasheet?partID=259862&src-supplier=Verical; ComponentLink4Description: https://www.verical.com/server-webapp/html/getDatasheet?partID=259862&src-supplier=Verical; Supplier Part Number 1: 497-10773-1-ND
U4#1 = BMI270: Accelerometer, Gyroscope, 6 Axis Sensor IÂ²C, SPI Output; MF: Bosch Sensortec; Price: None; SnapEDA_Link: https://www.snapeda.com/parts/BMI270/Bosch%20Sensortec/view-part/3595167/?ref=snap; MP: BMI270; Availability: Unavailable; Value: *; Package: LGA-14 Bosch Sensortec
U4#2 U5 = FILTER RC(PI) ESD SMD  8-UFDFN EP: RC (Pi) EMI Filter 2nd Order Low Pass 3 Channel R = 47Ohms, 100Ohms, C = 20pF  8-UFDFN Exposed Pad; Manufacturer: Texas Instruments; Number of Channels: 3; Operating Supply Voltage: 5.5V; ESD Protection: Yes; Clamping Voltage: 10V; Frequency: 308MHz; Supplier 1: Digi-Key; Manufacturer Part Number: TPD3F303DPVR; Stock 1: 4896; Pricing 1: 1=0.85, 10=0.812, 25=0.7856, 50=0.6414, 100=0.576, 250=0.5236, 500=0.4974, 1000=0.4451 (USD); Case/Package: SMD/SMT; Number of Pins: 8; Contact Plating: Gold; Min Operating Temperature: -40°C; Max Operating Temperature: 85°C; Package Quantity: 1; Packaging: Tape and Reel; Capacitance: 20pF; Termination: Flat; Length: 2.2mm; Height: 0.026inch; Width: 0.063inch; Depth: 1.7mm; Radiation Hardening: No; REACH SVHC: No SVHC; Lead Free: Lead Free; ComponentLink1URL: http://www.ti.com/lit/ds/symlink/tpd3f303.pdf?src-supplier=Digi-Key; ComponentLink1Description: http://www.ti.com/lit/ds/symlink/tpd3f303.pdf?src-supplier=Digi-Key; ComponentLink2URL: http://focus.ti.com/lit/ds/symlink/tpd3f303.pdf?src-supplier=Avnet+Europe; ComponentLink2Description: http://focus.ti.com/lit/ds/symlink/tpd3f303.pdf?src-supplier=Avnet+Europe; ComponentLink3URL: https://www.verical.com/server-webapp/html/getDatasheet?partID=302817&src-supplier=Verical; ComponentLink3Description: https://www.verical.com/server-webapp/html/getDatasheet?partID=302817&src-supplier=Verical; ComponentLink4URL: http://www.farnell.com/datasheets/1558442.pdf?src-supplier=Element14; ComponentLink4Description: http://www.farnell.com/datasheets/1558442.pdf?src-supplier=Element14; Supplier Part Number 1: 296-28299-1-ND; Mount: Surface Mount
U9 = TPS56339DDCR: 4.5-V to 24-V input, 3-A output synchronous buck converter 6-SOT-23-THIN -40 to 125; MF: Texas Instruments; Package: SOT-23-THN-6 Texas Instruments; Mouser-Purchase-URL: https://snapeda.com/shop?store=Mouser&id=4178121; Texas_Instruments-Purchase-URL: https://snapeda.com/shop?store=Texas+Instruments&id=4178121; Value: *; Price: None; DigiKey-Purchase-URL: https://snapeda.com/shop?store=DigiKey&id=4178121; MP: TPS56339DDCR; Availability: Good; SnapEDA_Link: https://www.snapeda.com/parts/TPS56339DDCR/Texas%20Instruments/view-part/4178121/?ref=snap